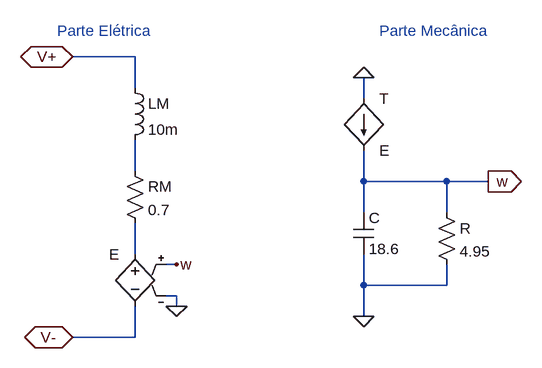
[diagram p0: schematic carga_motor.asc]
carga_motor.asc, the LTspice schematic file:
Version 4
SHEET 1 880 680
WIRE -16 -64 -112 -64
WIRE -16 -16 -16 -64
WIRE 336 0 336 -32
WIRE -16 112 -16 64
WIRE 336 128 336 80
WIRE 464 128 336 128
WIRE 528 128 464 128
WIRE 336 176 336 128
WIRE 464 176 464 128
WIRE -16 240 -16 192
WIRE 48 256 32 256
WIRE 336 288 336 240
WIRE 464 288 464 256
WIRE 464 288 336 288
WIRE 48 304 32 304
WIRE 48 320 48 304
WIRE 336 336 336 288
WIRE -16 368 -16 320
WIRE -16 368 -112 368
FLAG 336 -32 0
FLAG -112 -64 V+
IOPIN -112 -64 BiDir
FLAG -112 368 V-
IOPIN -112 368 BiDir
FLAG 48 320 0
FLAG 336 336 0
FLAG 528 128 w
IOPIN 528 128 Out
FLAG 48 256 w
SYMBOL ind -32 -32 R0
SYMATTR InstName LM
SYMATTR Value 10m
SYMBOL res -32 96 R0
SYMATTR InstName RM
SYMATTR Value 0.7
SYMBOL e -16 224 M0
SYMATTR InstName E
SYMATTR Value ""
SYMATTR Value2 1
SYMBOL cap 320 176 R0
SYMATTR InstName C
SYMATTR Value 18.6
SYMBOL res 448 160 R0
SYMATTR InstName R
SYMATTR Value 4.95
SYMBOL f 336 0 R0
SYMATTR InstName T
SYMATTR Value E
SYMATTR Value2 1
TEXT 360 -104 Left 2 ;Parte Mecânica
TEXT -136 -104 Left 2 ;Parte Elétrica

The netlist it stands for:
* carga_motor.asc
LM V+ N001 10m
RM N001 N002 0.7
E N002 V- w 0 1
C w 0 18.6
R w 0 4.95
F§T 0 w E 1
* Parte Mecânica
* Parte Elétrica
.backanno
.end